# EAGLE design CRMDisplay_V1 (EAGLE 5.06)
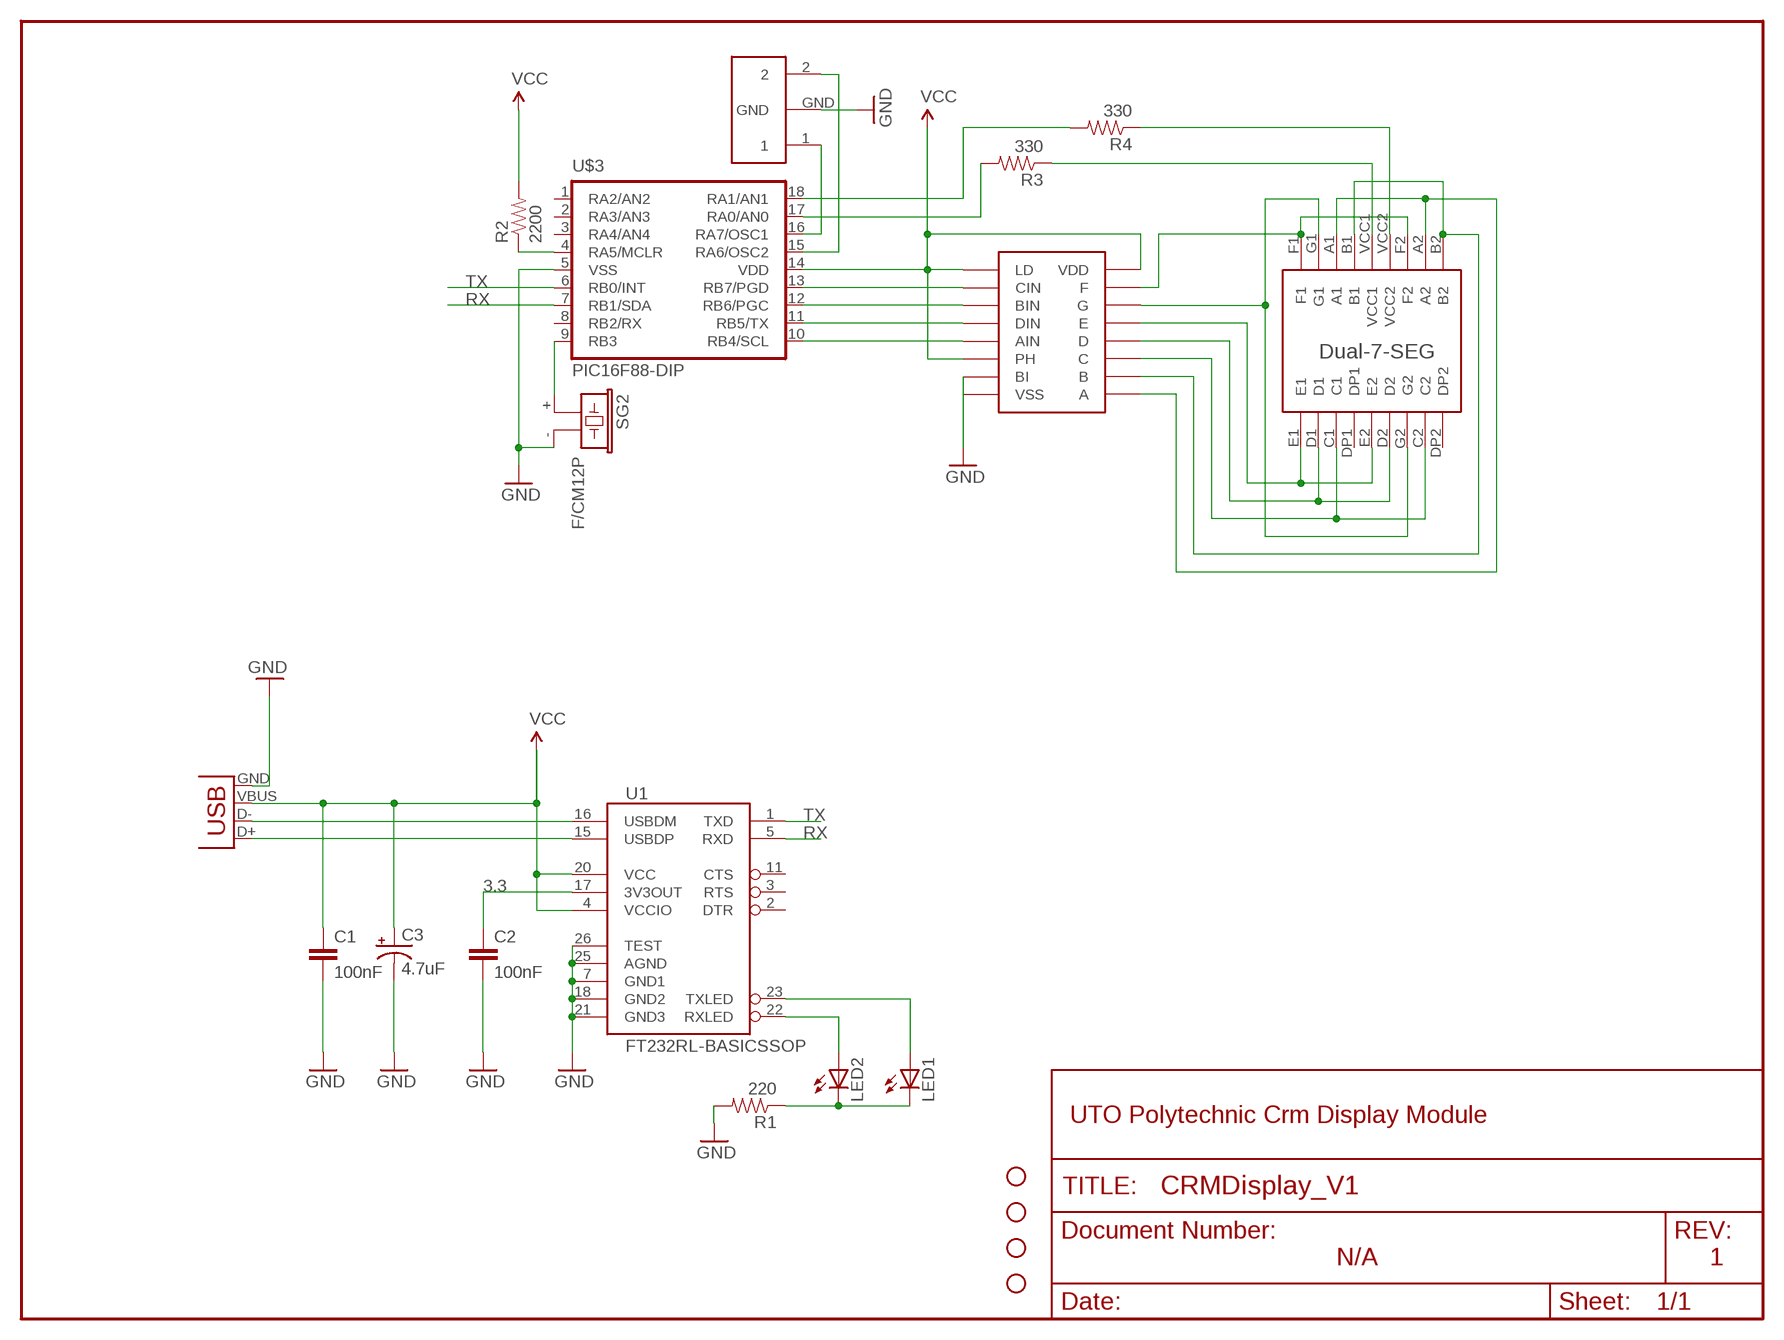
[diagram p0: schematic, sheet 1]

## Parts
C1  100nF  CAPPTH  [CAP-PTH-SMALL]
C2  100nF  CAPPTH  [CAP-PTH-SMALL]
C3  4.7uF  CAP_POLPTH2  [CPOL-RADIAL-10UF-25V]
JP2  STAND-OFF  [STAND-OFF]
JP3  STAND-OFF  [STAND-OFF]
JP4  STAND-OFF  [STAND-OFF]
JP5  STAND-OFF  [STAND-OFF]
LED1  LED3MM  [LED3MM]
LED2  LED3MM  [LED3MM]
OSC  OSC  [OSC]
R1  220  RESISTORPTH1  [AXIAL-0.3]
R2  2200  RESISTORPTH1  [AXIAL-0.3]
R3  330  RESISTORPTH1  [AXIAL-0.3]
R4  330  RESISTORPTH1  [AXIAL-0.3]
SG2  F/CM12P  [F/CM12P]
U1  FT232RL-BASICSSOP  [SSOP28DB]
U$1  DUAL-7-SEGMENT-DISPLAY  [DUAL-7-SEGMENT-DISPLAY]
U$3  PIC16F88-DIP  [DIL18]
U$4  MC14543B  [DIL18]
X1  USBSMD  [USB-MINIB]

## Nets
3.3: C2.1 U1.17(3V3OUT)
A: U$1.A1 U$1.A2 U$4.A
B: U$1.B1 U$1.B2 U$4.B
C: U$1.C1 U$1.C2 U$4.C
D: U$1.D1 U$1.D2 U$4.D
D+: U1.15(USBDP) X1.D+
E: U$1.E1 U$1.E2 U$4.E
F: U$1.F1 U$1.F2 U$4.F
G: U$1.G1 U$1.G2 U$4.G
GND: C1.2 C2.2 C3.2(-) OSC.GND R1.P$2 SG2.- U1.7(GND1) U1.18(GND2) U1.21(GND3) U1.25(AGND) U1.26(TEST) U$3.5(VSS) U$4.BI U$4.VSS X1.GND
N$1: U1.16(USBDM) X1.D-
N$2: R4.P$2 U$3.18(RA1/AN1)
N$3: LED2.A U1.22(RXLED)
N$4: LED1.A U1.23(TXLED)
N$5: U$3.13(RB7/PGD) U$4.CIN
N$6: LED1.K(C) LED2.K(C) R1.P$1
N$7: U$3.12(RB6/PGC) U$4.BIN
N$8: U$3.11(RB5/TX) U$4.DIN
N$9: U$3.10(RB4/SCL) U$4.AIN
N$10: R3.P$1 U$1.VCC1
N$11: R2.P$1 U$3.4(RA5/MCLR)
N$12: SG2.+ U$3.9(RB3)
N$14: OSC.1 U$3.16(RA7/OSC1)
N$15: OSC.2 U$3.15(RA6/OSC2)
N$17: R4.P$1 U$1.VCC2
N$18: R3.P$2 U$3.17(RA0/AN0)
RX: U1.5(RXD) U$3.7(RB1/SDA)
TX: U1.1(TXD) U$3.6(RB0/INT)
VCC: C1.1 C3.1(+) R2.P$2 U1.4(VCCIO) U1.20(VCC) U$3.14(VDD) U$4.LD U$4.PH U$4.VDD X1.VBUS
Unconnected: U1.2(DTR) U1.3(RTS) U1.11(CTS) U$1.DP1 U$1.DP2 U$3.1(RA2/AN2) U$3.2(RA3/AN3) U$3.3(RA4/AN4) U$3.8(RB2/RX)

## Notes on the sheet
- UTO Polytechnic Crm Display Module
- N/A | 1

## Library data of the parts
C1 C2 = SparkFun:CAP: Capacitor Standard 0603 ceramic capacitor, and 0.1" leaded capacitor.
C3 = SparkFun:CAP_POL: Capacitor Polarized These are standard SMD and PTH capacitors. Normally 10uF, 47uF, and 100uF in electrolytic and tantalum varieties. Always verify the external diameter of the through hole cap, it varies with capacity, voltage, and manufacturer. The EIA devices should be standard.
JP2-JP5 = SparkFun:STAND-OFF: Stand Off This is the mechanical footprint for a #4 phillips button head screw. Use the keepout ring to avoid running the screw head into surrounding components. SKU : PRT-00447
LED1 LED2 = SparkFun:LED: LEDs Standard schematic elements and footprints for 5mm, 3mm, 1206, and 0603 sized LEDs. 5mm - Spark Fun Electronics SKU : COM-00529 (and others)
OSC = Bock_Parts:OSC
R1-R4 = SparkFun:RESISTOR: Resistor Basic schematic elements and footprints for 0603, 1206, and PTH 1/10th watt (small) resistors.
SG2 = buzzer:F/CM12P: BUZZER Source: Buerklin
U1 = SparkFun:FT232RL-BASIC: USB UART This is the simplified version of the FT232RL unit. Only what you need, nothing you don't. Spark Fun Electronics SKU : COM-00650
U$1 = Bock_Parts:DUAL-7-SEGMENT-DISPLAY
U$3 = SparkFun:PIC16F88-DIP
U$4 = Bock_Parts:MC14543B: 7segment display driver/latch
X1 = SparkFun:USB: USB Connectors USB-B-PTH is fully proven SKU : PRT-00139 USB-miniB is fully proven SKU : PRT-00587 USB-A-PCB is untested. USB-A-H is throughly reviewed, but untested. Spark Fun Electronics SKU : PRT-00437 USB-B-SMT is throughly reviewed, but untested. Needs silkscreen touching up. USB-A-S has not been used/tested USB-MB-H has not been used/tested

## Board
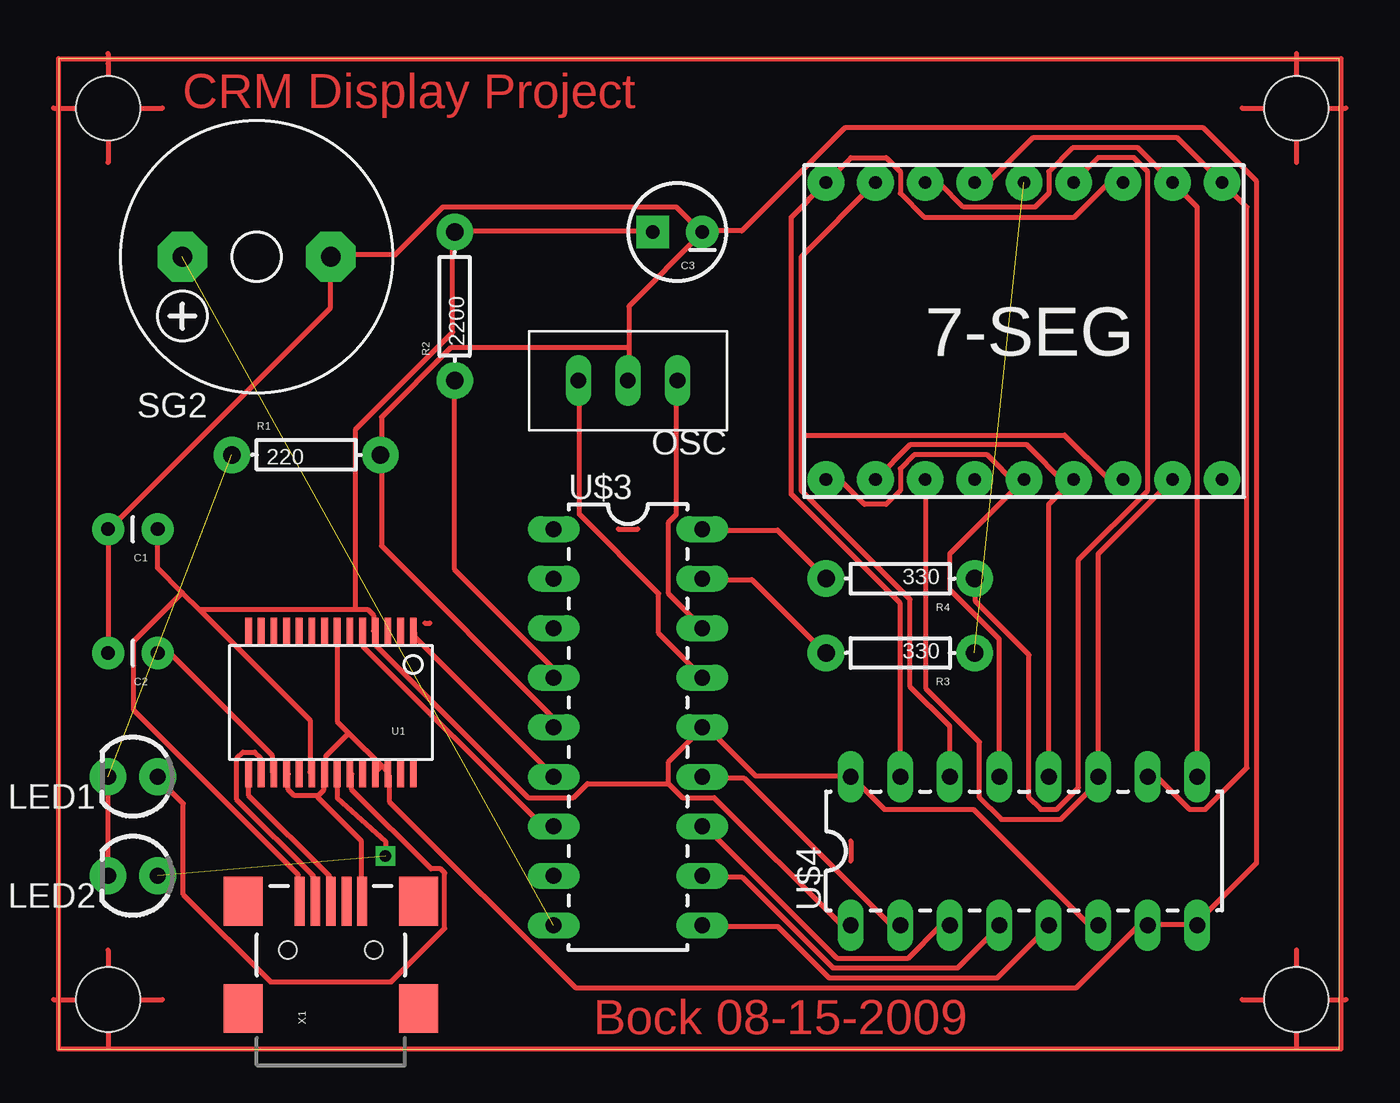
[diagram p1: board, top side]

Size 65.71 x 50.79 mm. Coordinates in mm from the lower left corner, seen from the top.
Outline: 0,0 65.71,0 65.71,50.79 0,50.79 0,0
Copper layers (1*16): Top 0.035mm / dielectric 1.5mm / Bottom 0.035mm
Design rules "default *": minimum track width 10mil, minimum drill 24mil, track to track 8mil, track to pad 8mil, pad to pad 8mil, via to via 8mil, smd to smd 8mil, copper to edge 40mil, drill to drill 8mil, minimum pad ring 10mil, minimum via ring 8mil, stop-mask expansion 4mil, vias tented up to drill 0mil, thermal gap 10mil

### Footprints (pad centres in the part's own frame; a part is rotated, then mirrored left to right if it is on the bottom)
CAP-PTH-SMALL = drill 0.7 pad 1.651 round: 1 0,0; 2 2.54,0
CPOL-RADIAL-10UF-25V = drill 0.7 pad 1.651 square: 1 1.27,0 | drill 0.7 pad 1.651 round: 2 -1.27,0
STAND-OFF = hole 3.302: 0,0
LED3MM = drill 0.813 pad 1.88 round: A -1.27,0; K 1.27,0
OSC = drill 0.8 long: 1 -2.54,0; 2 2.54,0; GND 0,0
AXIAL-0.3 = drill 0.9 pad 1.88 round: P$1 -3.81,0; P$2 3.81,0
F/CM12P = drill 1.016 pad 2.54 octagon: + 3.81,0; - -3.81,0
SSOP28DB = smd 0.348 x 1.397: 1 -4.225,-3.656; 2 -3.575,-3.656; 3 -2.925,-3.656; 4 -2.275,-3.656; 5 -1.625,-3.656; 6 -0.975,-3.656; 7 -0.325,-3.656; 8 0.325,-3.656; 9 0.975,-3.656; 10 1.625,-3.656; 11 2.275,-3.656; 12 2.925,-3.656; 13 3.575,-3.656; 14 4.225,-3.656; 15 4.225,3.656; 16 3.575,3.656; 17 2.925,3.656; 18 2.275,3.656; 19 1.625,3.656; 20 0.975,3.656; 21 0.325,3.656; 22 -0.325,3.656; 23 -0.975,3.656; 24 -1.625,3.656; 25 -2.275,3.656; 26 -2.925,3.656; 27 -3.575,3.656; 28 -4.225,3.656
DUAL-7-SEGMENT-DISPLAY = drill 0.65 pad 1.88 round: A1 0,7.62; A2 12.7,7.62; B1 2.54,7.62; B2 15.24,7.62; C1 0,-7.62; C2 12.7,-7.62; D1 -2.54,-7.62; D2 7.62,-7.62; DP1 2.54,-7.62; DP2 15.24,-7.62; E1 -5.08,-7.62; E2 5.08,-7.62; F1 -5.08,7.62; F2 10.16,7.62; G1 -2.54,7.62; G2 10.16,-7.62; VCC1 5.08,7.62; VCC2 7.62,7.62
DIL18 = drill 0.813 long: 1 -10.16,-3.81; 2 -7.62,-3.81; 3 -5.08,-3.81; 4 -2.54,-3.81; 5 0,-3.81; 6 2.54,-3.81; 7 5.08,-3.81; 8 7.62,-3.81; 9 10.16,-3.81; 10 10.16,3.81; 11 7.62,3.81; 12 5.08,3.81; 13 2.54,3.81; 14 0,3.81; 15 -2.54,3.81; 16 -5.08,3.81; 17 -7.62,3.81; 18 -10.16,3.81
DIL18' = drill 0.813 long: A 7.62,3.81; AIN 0,-3.81; B 5.08,3.81; BI 5.08,-3.81; BIN -5.08,-3.81; C 2.54,3.81; CIN -7.62,-3.81; D 0,3.81; DIN -2.54,-3.81; E -2.54,3.81; F -7.62,3.81; G -5.08,3.81; LD -10.16,-3.81; PH 2.54,-3.81; VDD -10.16,3.81; VSS 7.62,-3.81
USB-MINIB = smd 2.5 x 0.5: D+ 2.5,0; D- 2.5,0.8; GND 2.5,-1.6; ID 2.5,-0.8; VBUS 2.5,1.6 | smd 2.5 x 2: GND@1 -3,-4.5; GND@2 -3,4.5; GND@3 2.5,4.5; GND@4 2.5,-4.5 | hole 0.9: 0,2.2; 0,-2.2

### Placement (x,y rotation side)
C1  5.08,26.67 180 top
C2  5.08,20.32 180 top
C3  31.75,41.91 180 top
JP2  63.5,2.54 0 top
JP3  2.54,2.54 0 top
JP4  63.5,48.26 0 top
JP5  2.54,48.26 0 top
LED1  3.81,13.97 180 top
LED2  3.81,8.89 180 top
OSC  29.21,34.29 180 top
R1  12.7,30.48 0 top
R2  20.32,38.1 90 top
R3  43.18,20.32 180 top
R4  43.18,24.13 180 top
SG2  10.16,40.64 180 top
U1  13.97,17.78 180 top
U$1  44.45,36.83 0 top
U$3  29.21,16.51 270 top
U$4  MC14543B  [DIL18']  50.8,10.16 0 top
X1  13.97,5.08 90 top

### Tracks (layer width: path | path; a pad name or v marks a point on that pad's centre or on a via)
3.3
  Top 0.254: C2.1 5.69,20.32 10.97,15.04 10.97,14.22 U1.17
A
  Top 0.254: U$4.A 58.42,43.18 U$1.A2 55.37,46.23 52.02,46.23 50.8,45.01 50.8,43.89 50.09,43.18 46.43,43.18 45.21,44.4 44.5,44.4 U$1.A1
B
  Top 0.254: U$4.B 55.88,13.92 56.39,13.92 58.01,12.29 58.83,12.29 60.96,14.43 60.96,43.18 U$1.B2 57.4,46.74 49.99,46.74 47.75,44.5 47.04,44.5 U$1.B1
C
  Top 0.254: U$1.C2 53.34,25.4 U$4.C 53.24,13.92 53.24,13.61 51.41,11.79 48.36,11.79 47.24,12.9 47.24,15.75 44.5,18.49 44.5,29.16 U$1.C1
D
  Top 0.254: U$4.D 50.8,27.94 U$1.D2 51.71,28.96 49.68,30.99 43.69,30.99 U$1.D1
D+
  Top 0.254: U1.15 9.75,13.01 13.92,8.84 13.92,7.62 X1.D+
E
  Top 0.254: U$4.E 48.26,21.03 45.72,23.57 45.72,25.4 U$1.E2 49.17,28.96 47.65,30.48 43.89,30.48 43.18,29.77 43.18,28.65 42.47,27.94 41.35,27.94 40.13,29.16 39.42,29.16 U$1.E1
F
  Top 0.254: U$4.F 43.18,22.86 37.59,28.45 37.59,42.67 U$1.F1 40.64,45.72 42.47,45.72 43.18,45.01 43.18,43.89 44.4,42.67 52.12,42.67 53.85,44.4 54.56,44.4 U$1.F2
G
  Top 0.254: 38.1,31.5 38.1,40.64 U$1.G1 | 38.1,31.5 38.1,28.65 43.69,23.06 43.69,18.59 45.72,16.56 U$4.G | U$1.G2 54.56,29.26 53.85,29.26 51.61,31.5 38.1,31.5
GND
  Top 0.254: C2.2 C1.2 2.64,26.72 13.92,38 13.92,40.64 SG2.- 14.02,40.74 17.27,40.74 19.71,43.18 31.7,43.18 32.92,41.96 C3.2 | 29.26,35.97 29.26,38.1 33.02,41.86 C3.2 | 29.26,35.97 29.26,34.34 OSC.GND | U$3.5 25.4,16.97 16.56,25.81 16.56,30.48 R1.P$2 16.56,30.58 16.56,32.41 20.12,35.97 29.26,35.97 | 13.31,13.01 12.09,13.01 11.79,13.31 11.79,14.12 U1.18 | 13.31,13.01 13.61,13.31 13.61,14.12 U1.21 13.72,14.22 13.72,15.04 14.88,16.2 | 16.56,14.53 16.87,14.22 U1.26 16.97,14.02 16.97,12.7 26.52,3.15 52.22,3.15 55.37,6.3 55.78,6.3 U$4.BI 55.88,6.4 58.42,6.4 U$4.VSS 58.42,6.5 61.47,9.55 61.47,44.5 58.73,47.24 40.34,47.24 35.05,41.96 33.12,41.96 C3.2 | 14.88,16.2 16.56,14.53 | 14.88,16.2 14.33,16.76 14.33,21.34 U1.7 | 16.56,14.53 16.26,14.22 U1.25 | X1.GND 15.54,7.62 15.54,10.67 13.31,12.9 13.31,13.01
N$1
  Top 0.254: U1.16 10.36,14.22 10.36,14.94 10.06,15.24 9.45,15.24 9.14,14.94 9.14,12.8 13.11,8.84 13.11,7.62 X1.D-
N$2
  Top 0.254: U$3.18 33.02,26.62 36.88,26.62 R4.P$2
N$3  (1 unrouted)
  Top 0.254: U1.22 14.29,12.88 16.76,10.67 16.76,9.91
N$4
  Top 0.254: U1.23 15.04,14.12 15.04,13.31 19.1,9.25 19.61,9.25 19.81,9.04 19.81,6.2 17.07,3.45 10.87,3.45 6.4,7.92 6.4,12.6 5.08,13.92 LED1.A
N$5
  Top 0.254: U$4.CIN 43.18,6.4 42.67,6.4 35.15,13.92 33.02,13.92 U$3.13
N$6  (1 unrouted)
  Top 0.254: LED2.K LED1.K
N$7
  Top 0.254: U$4.BIN 45.72,6.3 45.21,6.3 43.59,4.67 39.93,4.67 33.22,11.38 33.02,11.38 U$3.12
N$8
  Top 0.254: U$3.11 33.02,8.84 35.05,8.84 39.73,4.17 46.13,4.17 48.26,6.3 U$4.DIN
N$9
  Top 0.254: U$3.10 33.02,6.3 36.88,6.3 39.52,3.66 48.16,3.66 50.8,6.3 U$4.AIN
N$10  (1 unrouted)
N$11
  Top 0.254: U$3.4 25.4,19.51 20.32,24.59 R2.P$1
N$12  (1 unrouted)
N$13  (via drill 0.6)
  other vias: 16.76,9.91
N$14
  Top 0.254: OSC.1 31.7,34.24 31.7,27.43 31.29,27.03 31.29,23.37 33.02,21.64 U$3.16
N$15
  Top 0.254: OSC.2 26.72,34.24 26.72,27.43 30.79,23.37 30.79,21.34 33.02,19.1 U$3.15
N$16
  Top 0.254: 18.8,21.84 19.05,21.84
N$17
  Top 0.254: R4.P$1 47.04,24.08 47.04,22.96 49.78,20.22 49.78,12.9 50.39,12.29 51.21,12.29 52.32,13.41 52.32,25.09 55.88,28.65 55.88,45.01 55.17,45.72 53.34,45.72 U$1.VCC2
N$18
  Top 0.254: U$3.17 33.02,24.08 35.56,24.08 39.32,20.32 R3.P$2
N$19
  Top 0.254: 28.7,26.67 29.72,26.67
N$20
  Top 0.254: 40.64,10.67 40.64,9.65
N$21
  Top 0.254: 2.54,50.8 2.54,50.55 | 2.54,50.55 2.54,45.47 | 2.54,51.05 2.54,50.55
N$22
  Top 0.254: -0.25,48.26 5.33,48.26
N$23
  Top 0.254: 2.54,5.08 2.54,0
N$24
  Top 0.254: -0.25,2.54 5.33,2.54
N$25
  Top 0.254: 63.5,51.05 63.5,45.47
N$26
  Top 0.254: 60.71,48.26 66.04,48.26
N$27
  Top 0.254: 63.5,5.08 63.5,0
N$28
  Top 0.254: 60.71,2.54 66.04,2.54
N$29
  Top 0.254: 0,50.8 65.79,50.8 65.79,0 0,0 0,50.8
RX
  Top 0.254: U1.5 15.65,21.34 15.65,20.62 24.79,11.48 25.4,11.48 U$3.7
TX
  Top 0.254: U1.1 18.29,21.34 18.29,21.13 25.4,14.02 U$3.6
VCC
  Top 0.254: 31.29,13.61 32,12.9 33.63,12.9 40.13,6.4 40.64,6.4 U$4.LD | 31.29,13.61 31.29,14.73 33.02,16.46 U$3.14 33.12,16.46 33.33,16.46 35.76,14.02 40.64,14.02 U$4.VDD 40.74,13.92 42.37,12.29 46.94,12.29 52.83,6.4 53.34,6.4 U$4.PH | C3.1 30.48,41.96 20.32,41.96 R2.P$2 20.22,41.86 20.22,36.78 15.24,31.8 15.24,22.55 | 6.35,23.42 5.08,24.69 C1.1 | 6.35,23.42 7.26,22.5 | 7.26,22.5 12.9,16.87 12.9,14.22 U1.20 | 15.24,22.55 7.32,22.55 7.26,22.5 | 15.24,22.55 15.85,22.55 16.15,22.25 16.15,21.44 U1.4 16.26,21.34 16.26,20.73 24.08,12.9 26.42,12.9 27.13,13.61 31.29,13.61 | X1.VBUS 12.29,7.62 12.29,8.94 3.86,17.37 3.86,20.93 6.35,23.42

### Text on the board
Top: CRM Display Project | Bock 08-15-2009